# EAGLE design BUZZI-19b (EAGLE 4.15)
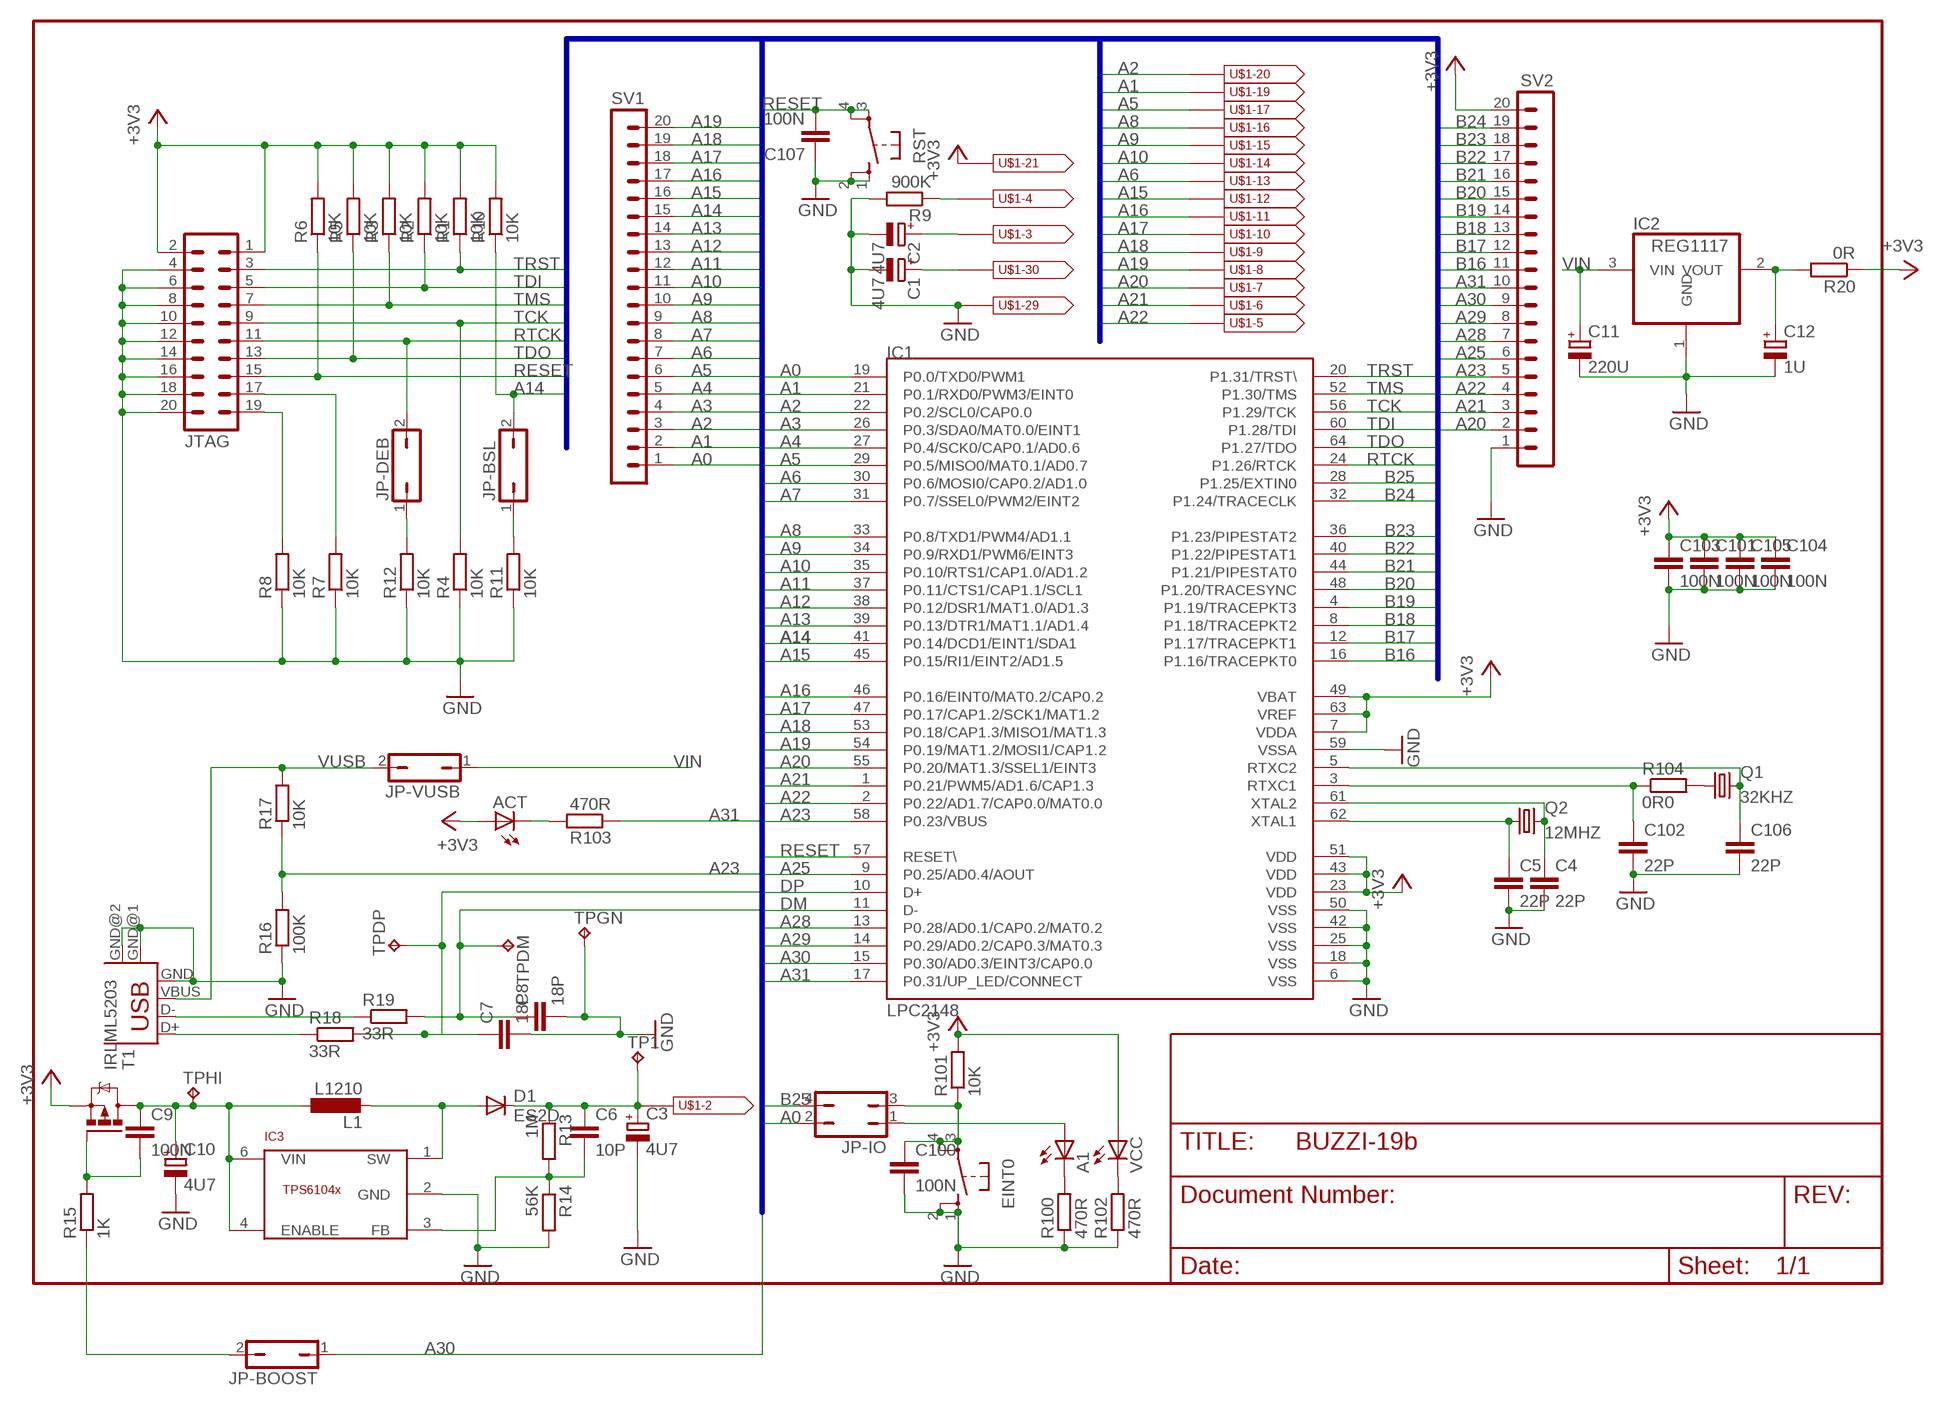
[diagram p0: schematic, sheet 1]

## Parts
A1  LEDCHIP-LED0805  [CHIP-LED0805]
ACT  LEDCHIP-LED0805  [CHIP-LED0805]
C1  4U7  CPOL-EUCT3528  [CT3528]
C2  4U7  CPOL-EUCT3528  [CT3528]
C3  4U7  CPOL-EUCT3528  [CT3528]
C4  22P  C-EUC0805  [C0805]
C5  22P  C-EUC0805  [C0805]
C6  10P  C-EUC0805  [C0805]
C7  18P  C-EUC0805  [C0805]
C8  18P  C-EUC0805  [C0805]
C9  100N  C-EUC0805  [C0805]
C10  4U7  CPOL-EUCT3528  [CT3528]
C11  220U  CPOL-EUCT7343  [CT7343]
C12  1U  CPOL-EUCT3528  [CT3528]
C100  100N  C-EUC0805  [C0805]
C101  100N  C-EUC0805  [C0805]
C102  22P  C-EUC0805  [C0805]
C103  100N  C-EUC0805  [C0805]
C104  100N  C-EUC0805  [C0805]
C105  100N  C-EUC0805  [C0805]
C106  22P  C-EUC0805  [C0805]
C107  100N  C-EUC0805  [C0805]
D1  ES2D  [SMB]
EINT0  10XX  [B3F-10XX]
IC1  LPC2148  LPC2148FBD64  [TSQFP50P1200X1200X160-64N]
IC2  REG1117  [SOT223]
IC3  TPS6104X  [SOT23-6L]
JP-BOOST  JP1Q  [JP1]
JP-BSL  JP1Q  [JP1]
JP-DEB  JP1Q  [JP1]
JP-IO  JP2Q  [JP2Q]
JP-VUSB  JP1Q  [JP1]
JTAG  MA10-2  [MA10-2]
L1  L1210  [C1210]
Q1  32KHZ  CRYTALTC26V  [TC26V]
Q2  12MHZ  CRYTALHC49UP  [HC49UP]
R1  10K  R-EU_M0805  [M0805]
R2  10K  R-EU_M0805  [M0805]
R3  10K  R-EU_M0805  [M0805]
R4  10K  R-EU_M0805  [M0805]
R5  10K  R-EU_M0805  [M0805]
R6  10K  R-EU_M0805  [M0805]
R7  10K  R-EU_M0805  [M0805]
R8  10K  R-EU_M0805  [M0805]
R9  900K  R-EU_M0805  [M0805]
R10  10K  R-EU_M0805  [M0805]
R11  10K  R-EU_M0805  [M0805]
R12  10K  R-EU_M0805  [M0805]
R13  1M  R-EU_M0805  [M0805]
R14  56K  R-EU_M0805  [M0805]
R15  1K  R-EU_M0805  [M0805]
R16  100K  R-EU_M0805  [M0805]
R17  10K  R-EU_M0805  [M0805]
R18  33R  R-EU_M0805  [M0805]
R19  33R  R-EU_M0805  [M0805]
R20  0R  R-EU_M0805  [M0805]
R100  470R  R-EU_M0805  [M0805]
R101  10K  R-EU_M0805  [M0805]
R102  470R  R-EU_M0805  [M0805]
R103  470R  R-EU_M0805  [M0805]
R104  0R0  R-EU_M0805  [M0805]
RST  10XX  [B3F-10XX]
SV1  MA20-1  [MA20-1]
SV2  MA20-1  [MA20-1]
T1  IRLML5203  [MICRO3]
TP1  TPPAD1-13  [P1-13]
TPDM  TPPAD1-13  [P1-13]
TPDP  TPPAD1-13  [P1-13]
TPGN  TPPAD1-13  [P1-13]
TPHI  TPPAD1-13  [P1-13]
U$1  CONNECTOR30  [HIROSE-FH12-30S-05SH]
USB  USB-MB-H  [USB-MB-H]
VCC  LEDCHIP-LED0805  [CHIP-LED0805]

## Nets
+3V3: ACT.A C101.1 C103.1 C104.1 C105.1 IC1.7(VDDA) IC1.23(VDD) IC1.43(VDD) IC1.49(VBAT) IC1.51(VDD) IC1.63(VREF) JTAG.1 JTAG.2 R1.2 R2.2 R3.2 R5.2 R6.2 R10.2 R20.1 R101.2 SV2.20 T1.2(S) U$1.P$21 VCC.A
A0: IC1.19(P0.0/TXD0/PWM1) JP-IO.2 SV1.1
A1: IC1.21(P0.1/RXD0/PWM3/EINT0) SV1.2 U$1.P$19
A2: IC1.22(P0.2/SCL0/CAP0.0) SV1.3 U$1.P$20
A3: IC1.26(P0.3/SDA0/MAT0.0/EINT1) SV1.4
A4: IC1.27(P0.4/SCK0/CAP0.1/AD0.6) SV1.5
A5: IC1.29(P0.5/MISO0/MAT0.1/AD0.7) SV1.6 U$1.P$17
A6: IC1.30(P0.6/MOSI0/CAP0.2/AD1.0) SV1.7 U$1.P$13
A7: IC1.31(P0.7/SSEL0/PWM2/EINT2) SV1.8
A8: IC1.33(P0.8/TXD1/PWM4/AD1.1) SV1.9 U$1.P$16
A9: IC1.34(P0.9/RXD1/PWM6/EINT3) SV1.10 U$1.P$15
A10: IC1.35(P0.10/RTS1/CAP1.0/AD1.2) SV1.11 U$1.P$14
A11: IC1.37(P0.11/CTS1/CAP1.1/SCL1) SV1.12
A12: IC1.38(P0.12/DSR1/MAT1.0/AD1.3) SV1.13
A13: IC1.39(P0.13/DTR1/MAT1.1/AD1.4) SV1.14
A14: IC1.41(P0.14/DCD1/EINT1/SDA1) JP-BSL.2 R10.1 SV1.15
A15: IC1.45(P0.15/RI1/EINT2/AD1.5) SV1.16 U$1.P$12
A16: IC1.46(P0.16/EINT0/MAT0.2/CAP0.2) SV1.17 U$1.P$11
A17: IC1.47(P0.17/CAP1.2/SCK1/MAT1.2) SV1.18 U$1.P$10
A18: IC1.53(P0.18/CAP1.3/MISO1/MAT1.3) SV1.19 U$1.P$9
A19: IC1.54(P0.19/MAT1.2/MOSI1/CAP1.2) SV1.20 U$1.P$8
A20: IC1.55(P0.20/MAT1.3/SSEL1/EINT3) SV2.2 U$1.P$7
A21: IC1.1(P0.21/PWM5/AD1.6/CAP1.3) SV2.3 U$1.P$6
A22: IC1.2(P0.22/AD1.7/CAP0.0/MAT0.0) SV2.4 U$1.P$5
A23: IC1.58(P0.23/VBUS) R16.2 R17.1 SV2.5
A25: IC1.9(P0.25/AD0.4/AOUT) SV2.6
A28: IC1.13(P0.28/AD0.1/CAP0.2/MAT0.2) SV2.7
A29: IC1.14(P0.29/AD0.2/CAP0.3/MAT0.3) SV2.8
A30: IC1.15(P0.30/AD0.3/EINT3/CAP0.0) JP-BOOST.1 SV2.9
A31: IC1.17(P0.31/UP_LED/CONNECT) R103.1 SV2.10
B16: IC1.16(P1.16/TRACEPKT0) SV2.11
B17: IC1.12(P1.17/TRACEPKT1) SV2.12
B18: IC1.8(P1.18/TRACEPKT2) SV2.13
B19: IC1.4(P1.19/TRACEPKT3) SV2.14
B20: IC1.48(P1.20/TRACESYNC) SV2.15
B21: IC1.44(P1.21/PIPESTAT0) SV2.16
B22: IC1.40(P1.22/PIPESTAT1) SV2.17
B23: IC1.36(P1.23/PIPESTAT2) SV2.18
B24: IC1.32(P1.24/TRACECLK) SV2.19
B25: IC1.28(P1.25/EXTIN0) JP-IO.4
DM: C8.1 IC1.11(D-) R19.2 TPDM.1(TP)
DP: C7.1 IC1.10(D+) R18.2 TPDP.1(TP)
GND: C1.- C2.- C3.- C4.2 C5.2 C7.2 C8.2 C10.- C11.- C12.- C100.2 C101.2 C102.2 C103.2 C104.2 C105.2 C106.2 C107.1 EINT0.1 EINT0.2 IC1.6(VSS) IC1.18(VSS) IC1.25(VSS) IC1.42(VSS) IC1.50(VSS) IC1.59(VSSA) IC2.1(GND) IC3.2(GND) JTAG.4 JTAG.6 JTAG.8 JTAG.10 JTAG.12 JTAG.14 JTAG.16 JTAG.18 JTAG.20 R4.1 R7.1 R8.1 R9.2 R11.1 R12.1 R14.2 R16.1 R100.1 R102.1 RST.1 RST.2 SV2.1 TPGN.1(TP) U$1.P$29 USB.GND USB.GND@1(GND) USB.GND@2(GND)
N$1: Q1.1 R104.2
N$2: JP-DEB.1 R12.2
N$3: R19.1 USB.D-
N$4: R18.1 USB.D+
N$5: JP-BSL.1 R11.2
N$6: C1.+ U$1.P$30
N$7: ACT.C R103.2
N$8: JTAG.17 R7.2
N$9: C100.1 EINT0.3 EINT0.4 JP-IO.3 R101.1
N$10: JTAG.19 R8.2
N$11: A1.A JP-IO.1
N$12: A1.C R100.2
N$13: R102.2 VCC.C
N$14: C9.1 C10.+ IC3.4(ENABLE) IC3.6(VIN) L1.1 T1.3(D) TPHI.1(TP)
N$15: C2.+ U$1.P$3
N$16: R9.1 U$1.P$4
N$17: D1.A IC3.1(SW) L1.2
N$18: C3.+ C6.1 D1.C R13.1 TP1.1(TP) U$1.P$2
N$19: C6.2 IC3.3(FB) R13.2 R14.1
N$20: C12.+ IC2.2(VOUT) R20.2
N$21: C9.2 R15.2 T1.1(G)
N$22: JP-BOOST.2 R15.1
N$23: C5.1 IC1.62(XTAL1) Q2.1
N$24: C4.1 IC1.61(XTAL2) Q2.2
N$25: C102.1 IC1.3(RTXC1) R104.1
N$26: C106.1 IC1.5(RTXC2) Q1.2
RESET: C107.2 IC1.57(RESET\) JTAG.15 R6.1 RST.3 RST.4
RTCK: IC1.24(P1.26/RTCK) JP-DEB.2 JTAG.11
TCK: IC1.56(P1.29/TCK) JTAG.9 R4.2
TDI: IC1.60(P1.28/TDI) JTAG.5 R2.1
TDO: IC1.64(P1.27/TDO) JTAG.13 R5.1
TMS: IC1.52(P1.30/TMS) JTAG.7 R3.1
TRST: IC1.20(P1.31/TRST\) JTAG.3 R1.1
VIN: C11.+ IC2.3(VIN) JP-VUSB.1
VUSB: JP-VUSB.2 R17.2 USB.VBUS
Unconnected: U$1.P$1 U$1.P$18 U$1.P$22 U$1.P$23 U$1.P$24 U$1.P$25 U$1.P$26 U$1.P$27 U$1.P$28

## Buses
ARM7:A[0..31],B[0..31],RESET,DP,DM,TRST,TMS,TCK,TDI,TDO,RTCK

## Library data of the parts
A1 ACT VCC = led:LED: LED OSRAM: - CHIPLED LG R971, LG N971, LY N971, LG Q971, LY Q971, LO R971, LY R971 LH N974, LH R974 LS Q976, LO Q976, LY Q976 LO Q996 - Hyper CHIPLED LW Q18S LB Q993, LB Q99A, LB R99A - SideLED LS A670, LO A670, LY A670, LG A670, LP A670 LB A673, LV A673, LT A673, LW A673 LH A674 LY A675 LS A676, LA A676, LO A676, LY A676, LW A676 LS A679, LY A679, LG A679 - Hyper Micro SIDELED® LS Y876, LA Y876, LO Y876, LY Y876 LT Y87S - SmartLED LW L88C, LW L88S LB L89C, LB L89S, LG L890 LS L89K, LO L89K, LY L89K LS L896, LA L896, LO L896, LY L896 - TOPLED LS T670, LO T670, LY T670, LG T670, LP T670 LSG T670, LSP T670, LSY T670, LOP T670, LYG T670 LG T671, LOG T671, LSG T671 LB T673, LV T673, LT T673, LW T673 LH T674 LS T676, LA T676, LO T676, LY T676, LB T676, LH T676, LSB T676, LW T676 LB T67C, LV T67C, LT T67C, LS T67K, LO T67K, LY T67K, LW E67C LS E67B, LA E67B, LO E67B, LY E67B, LB E67C, LV E67C, LT E67C LW T67C LS T679, LY T679, LG T679 LS T770, LO T770, LY T770, LG T770, LP T770 LB T773, LV T773, LT T773, LW T773 LH T774 LS E675, LA E675, LY E675, LS T675 LS T776, LA T776, LO T776, LY T776, LB T776 LHGB T686 LT T68C, LB T68C - Hyper Mini TOPLED® LB M676 - Mini TOPLED Santana® LG M470 LS M47K, LO M47K, LY M47K Source: http://www.osram.convergy.de/
C1-C3 C10-C12 = rcl:CPOL-EU: POLARIZED CAPACITOR, European symbol
C4-C9 C100-C107 = rcl:C-EU: CAPACITOR, European symbol
D1 = diode:ES2D: DIODE super fast rectifier, 2 A
EINT0 RST = KEY_B:10XX
IC1 = philips-5:LPC2148
IC2 = burr-brown:REG1117: 800mA and 1A Low Dropout (LDO) Positive Regulator 1.8V, 2.5V, 2.85V, 3.3V, 5V, and Adj
IC3 = turbod3:TPS6104X
JP-BOOST JP-BSL JP-DEB JP-VUSB = jumper:JP1Q: JUMPER
JP-IO = jumper:JP2Q: JUMPER
JTAG = con-lstb:MA10-2: PIN HEADER
L1 = turbod3:L
Q1 = crystal:CRYTAL: CRYSTAL
Q2 = turbod3:CRYTAL: CRYSTAL
R1-R20 R100-R104 = rcl:R-EU_: RESISTOR, European symbol
SV1 SV2 = turbod3:MA20-1: PIN HEADER
T1 = transistor-power:IRLML5203: HEXFET P-Channel Power MOSFET
TP1 TPDM TPDP TPGN TPHI = testpad:TP
U$1 = turbod3:CONNECTOR30
USB = con-usb-2:USB: USB Connectors

## Board
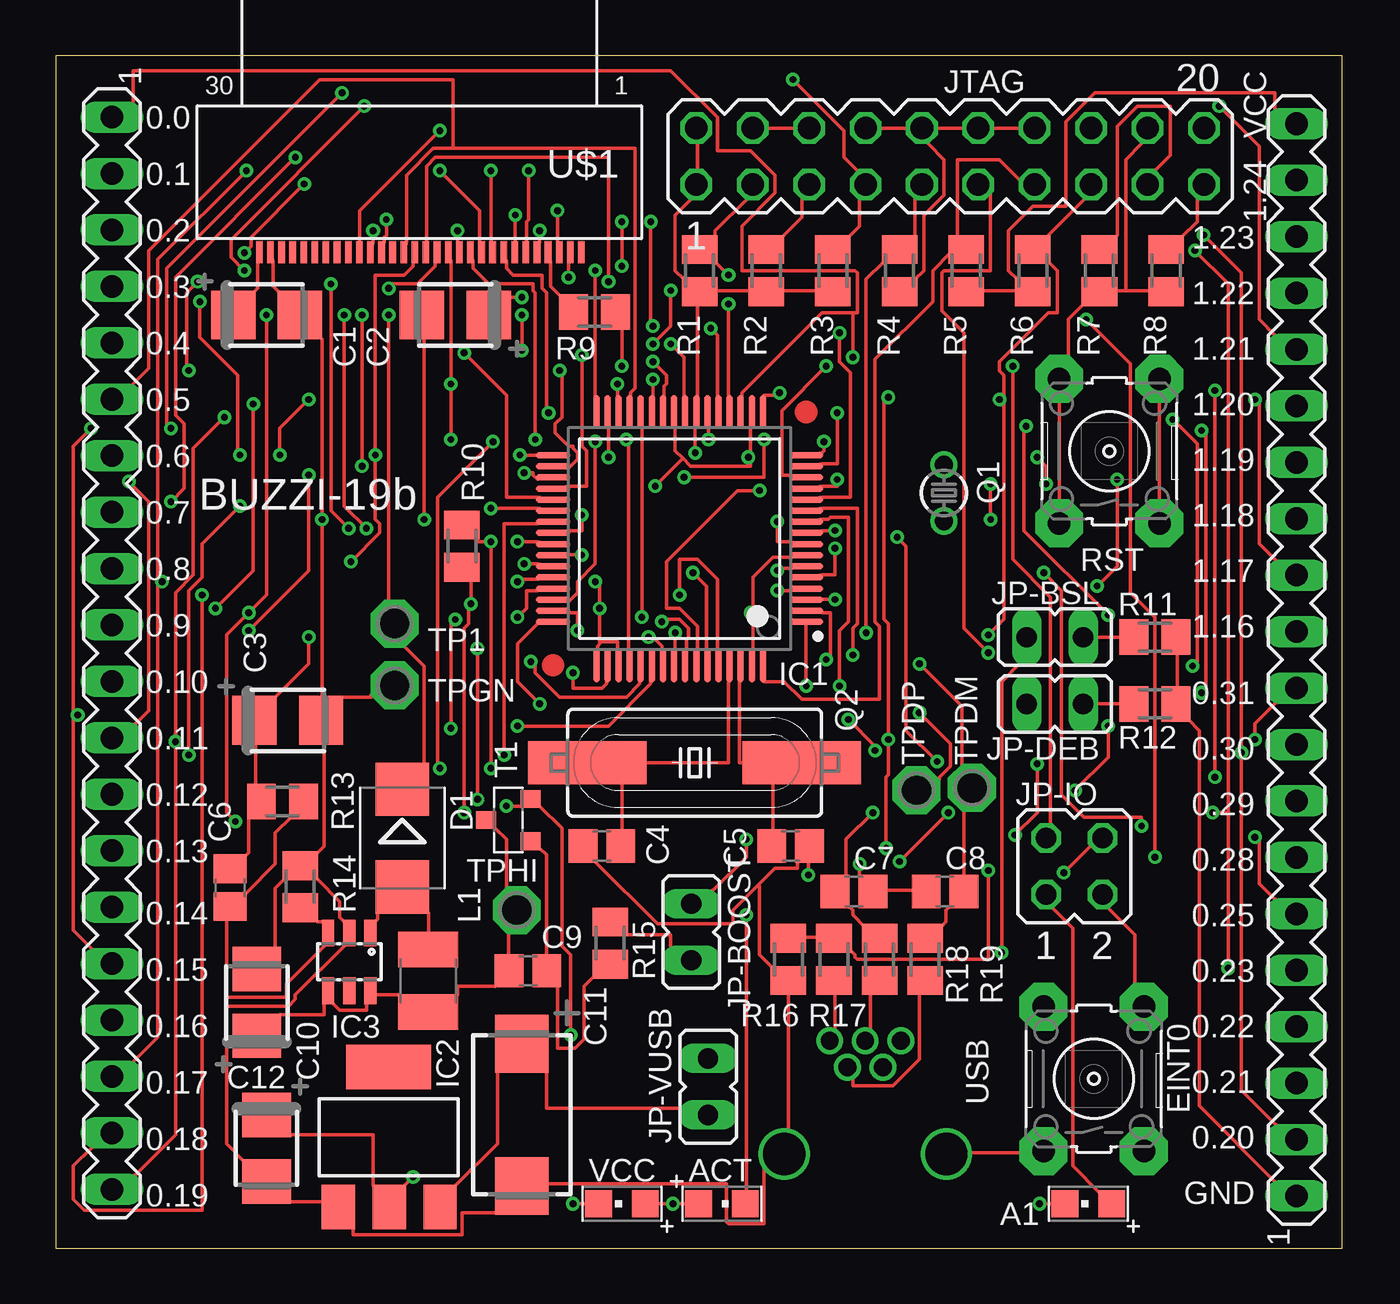
[diagram p1: board, top side]
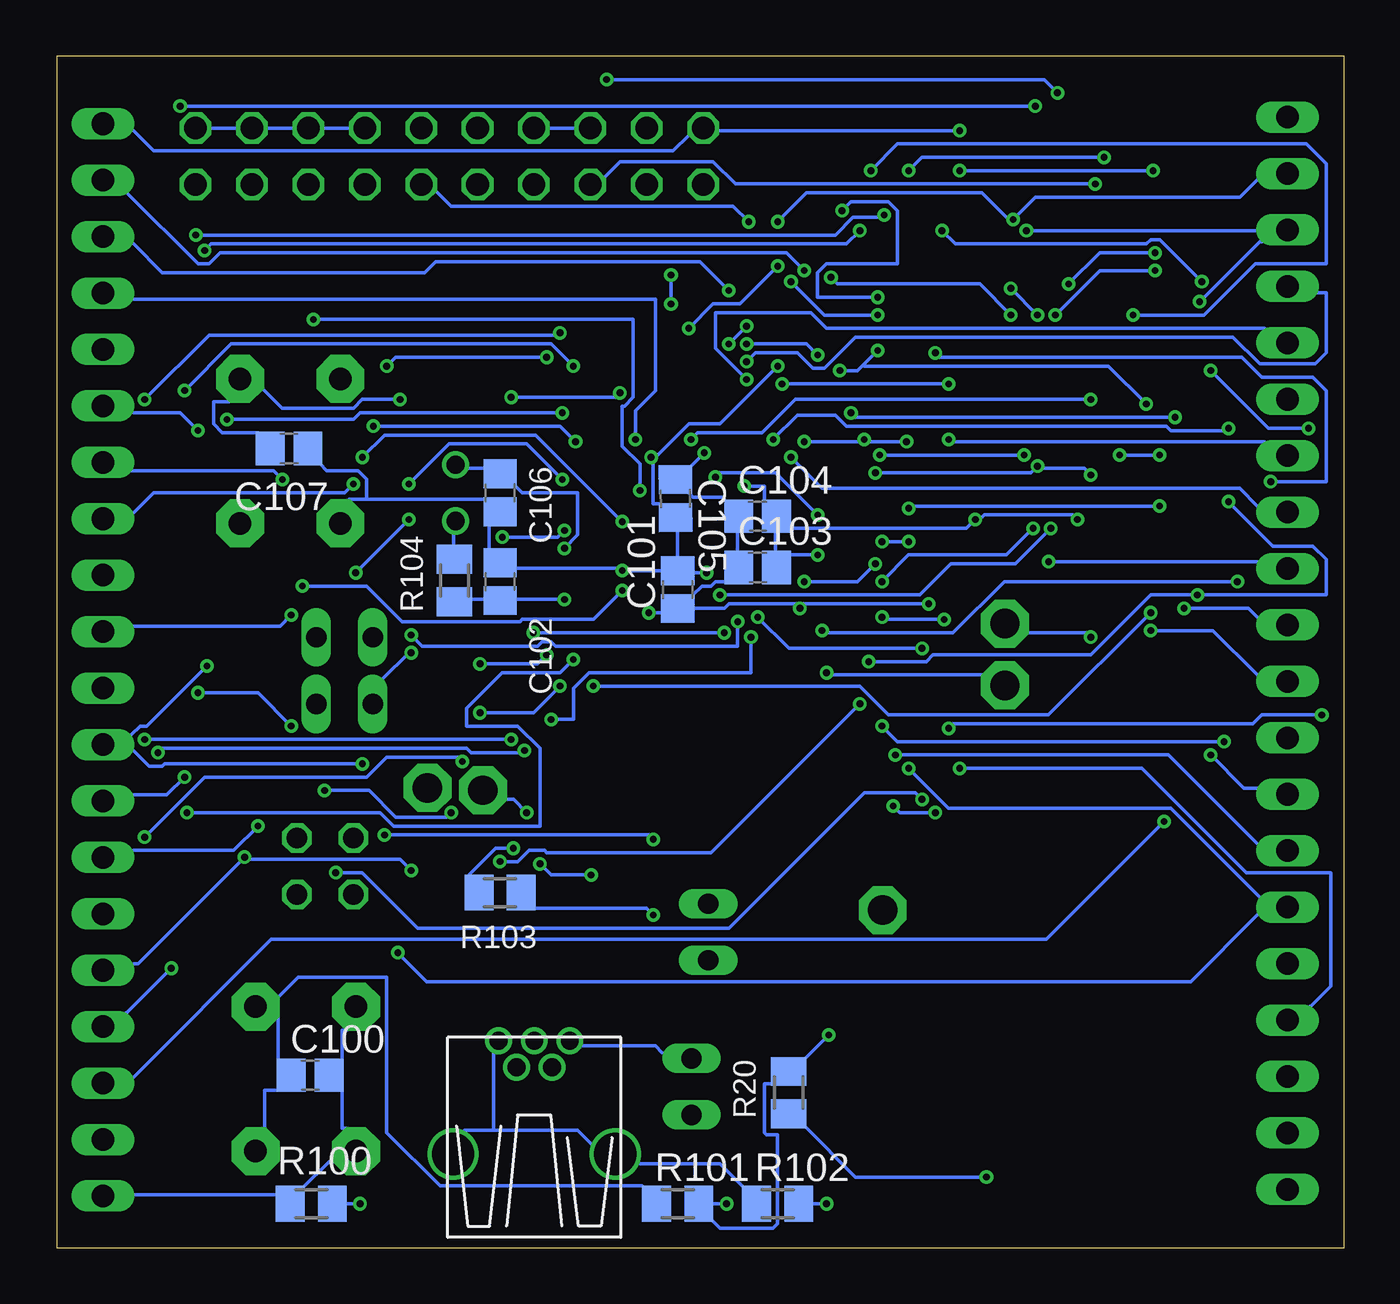
[diagram p2: board, bottom side, seen from below]

Size 57.94 x 53.68 mm. Coordinates in mm from the lower left corner, seen from the top.
Outline: 0,0 57.94,0 57.94,53.68 0,53.68 0,0
Copper layers (1*16): Top 0.035mm / dielectric 1.5mm / Bottom 0.035mm
Design rules "PCB-POOL": minimum track width 6mil, minimum drill 12mil, track to track 6mil, track to pad 6mil, pad to pad 6mil, via to via 6mil, smd to smd 6mil, copper to edge 20mil, drill to drill 8mil, minimum pad ring 8mil, minimum via ring 6mil, stop-mask expansion 3mil, vias tented up to drill 0mil, thermal gap 8mil

### Footprints (pad centres in the part's own frame; a part is rotated, then mirrored left to right if it is on the bottom)
CHIP-LED0805 = smd 1.2 x 1.2: A 0,-1.05; C 0,1.05
CT3528 = smd 2 x 2.2: + 1.5,0; - -1.5,0
C0805 = smd 1.3 x 1.5: 1 -0.85,0; 2 0.85,0
CT7343 = smd 2.6 x 2.4: + 3.2,0; - -3.2,0
SMB = smd 2.4 x 2.4: A 2.2,0; C -2.2,0
B3F-10XX = drill 1.016 pad 2.159 octagon: 1 -3.379,2.312; 2 3.123,2.312; 3 -3.379,-2.209; 4 3.123,-2.209
TSQFP50P1200X1200X160-64N = smd 1.55 x 0.3: 1 -5.7,3.75; 2 -5.7,3.25; 3 -5.7,2.75; 4 -5.7,2.25; 5 -5.7,1.75; 6 -5.7,1.25; 7 -5.7,0.75; 8 -5.7,0.25; 9 -5.7,-0.25; 10 -5.7,-0.75; 11 -5.7,-1.25; 12 -5.7,-1.75; 13 -5.7,-2.25; 14 -5.7,-2.75; 15 -5.7,-3.25; 16 -5.7,-3.75; 33 5.7,-3.75; 34 5.7,-3.25; 35 5.7,-2.75; 36 5.7,-2.25; 37 5.7,-1.75; 38 5.7,-1.25; 39 5.7,-0.75; 40 5.7,-0.25; 41 5.7,0.25; 42 5.7,0.75; 43 5.7,1.25; 44 5.7,1.75; 45 5.7,2.25; 46 5.7,2.75; 47 5.7,3.25; 48 5.7,3.75 | smd 0.3 x 1.55: 17 -3.75,-5.7; 18 -3.25,-5.7; 19 -2.75,-5.7; 20 -2.25,-5.7; 21 -1.75,-5.7; 22 -1.25,-5.7; 23 -0.75,-5.7; 24 -0.25,-5.7; 25 0.25,-5.7; 26 0.75,-5.7; 27 1.25,-5.7; 28 1.75,-5.7; 29 2.25,-5.7; 30 2.75,-5.7; 31 3.25,-5.7; 32 3.75,-5.7; 49 3.75,5.7; 50 3.25,5.7; 51 2.75,5.7; 52 2.25,5.7; 53 1.75,5.7; 54 1.25,5.7; 55 0.75,5.7; 56 0.25,5.7; 57 -0.25,5.7; 58 -0.75,5.7; 59 -1.25,5.7; 60 -1.75,5.7; 61 -2.25,5.7; 62 -2.75,5.7; 63 -3.25,5.7; 64 -3.75,5.7
SOT223 = smd 1.499 x 2.007: 1 -2.261,-3.15; 2 0.025,-3.15; 3 2.311,-3.15 | smd 3.81 x 2.007: 4 0,3.15
SOT23-6L = smd 0.55 x 1.2: 1 -0.95,-1.3; 2 0,-1.3; 3 0.95,-1.3; 4 0.95,1.3; 5 0,1.3; 6 -0.95,1.3
JP1 = drill 0.914 long: 1 0,-1.27; 2 0,1.27
JP2Q = drill 0.914 octagon: 1 -1.27,-1.27; 2 -1.27,1.27; 3 1.27,-1.27; 4 1.27,1.27
MA10-2 = drill 1.016 octagon: 1 -11.43,-1.27; 2 -11.43,1.27; 3 -8.89,-1.27; 4 -8.89,1.27; 5 -6.35,-1.27; 6 -6.35,1.27; 7 -3.81,-1.27; 8 -3.81,1.27; 9 -1.27,-1.27; 10 -1.27,1.27; 11 1.27,-1.27; 12 1.27,1.27; 13 3.81,-1.27; 14 3.81,1.27; 15 6.35,-1.27; 16 6.35,1.27; 17 8.89,-1.27; 18 8.89,1.27; 19 11.43,-1.27; 20 11.43,1.27
C1210 = smd 1.6 x 2.7: 1 -1.4,0; 2 1.4,0
TC26V = drill 0.813 round: 1 -1.27,0; 2 1.27,0
HC49UP = smd 5.334 x 1.93: 1 -4.826,0; 2 4.826,0
M0805 = smd 1.3 x 1.6: 1 -0.95,0; 2 0.95,0
MA20-1 = drill 1.016 long: 1 -24.13,0; 2 -21.59,0; 3 -19.05,0; 4 -16.51,0; 5 -13.97,0; 6 -11.43,0; 7 -8.89,0; 8 -6.35,0; 9 -3.81,0; 10 -1.27,0; 11 1.27,0; 12 3.81,0; 13 6.35,0; 14 8.89,0; 15 11.43,0; 16 13.97,0; 17 16.51,0; 18 19.05,0; 19 21.59,0; 20 24.13,0
MICRO3 = smd 0.8 x 0.9: 1 -0.95,-1; 2 0.95,-1; 3 0,1
P1-13 = drill 1.321 pad 2.159 octagon: 1 0,0
HIROSE-FH12-30S-05SH = smd 0.3 x 1: P$1 -7.3,3.6; P$2 -6.8,3.6; P$3 -6.3,3.6; P$4 -5.8,3.6; P$5 -5.3,3.6; P$6 -4.8,3.6; P$7 -4.3,3.6; P$8 -3.8,3.6; P$9 -3.3,3.6; P$10 -2.8,3.6; P$11 -2.3,3.6; P$12 -1.8,3.6; P$13 -1.3,3.6; P$14 -0.8,3.6; P$15 -0.3,3.6; P$16 0.2,3.6; P$17 0.7,3.6; P$18 1.2,3.6; P$19 1.7,3.6; P$20 2.2,3.6; P$21 2.7,3.6; P$22 3.2,3.6; P$23 3.7,3.6; P$24 4.2,3.6; P$25 4.7,3.6; P$26 5.2,3.6; P$27 5.7,3.6; P$28 6.2,3.6; P$29 6.7,3.6; P$30 7.2,3.6
USB-MB-H = drill 0.8 round: D+ 5.1,0; D- 3.9,0.8; GND 5.1,-1.6; ID 3.9,-0.8; VBUS 5.1,1.6 | drill 1.9 round: GND@1 0,3.65; GND@2 0,-3.65

### Placement (x,y rotation side)
A1  46.5,2 90 top
ACT  30,2 270 top
C1  9.5,42 180 top
C2  18,42 0 top
C3  10.46,23.76 180 top
C4  24.6,18.1 180 top
C5  33.1,18.1 0 top
C6  7.86,16.23 270 top
C7  35.95,16.05 0 top
C8  40.05,16.05 180 top
C9  21.27,12.49 0 top
C10  9.07,11.06 270 top
C11  21,6 90 top
C12  9.5,4.5 90 top
C100  46.55,7.78 0 bottom
C101  30,29.64 90 bottom
C102  38,30 90 bottom
C103  26.4,30.64 0 bottom
C104  26.4,32.94 0 bottom
C105  30.1,33.74 270.4 bottom
C106  38,34 270 bottom
C107  47.5,36 180 bottom
D1  15.61,18.46 270 top
EINT0  46.8,7.75 90 top
IC1  28.1,31.94 180 top
IC2  15,5 0 top
IC3  13.23,12.89 180 top
JP-BOOST  28.62,14.23 180 top
JP-BSL  45,27.5 90 top
JP-DEB  45,24.5 90 top
JP-IO  45.87,17.19 0 top
JP-VUSB  29.38,7.27 0 top
JTAG  40.28,49.14 0 top
L1  16.78,12.04 90 top
Q1  40,34 90 top
Q2  28.78,21.85 180 top
R1  29,44 270 top
R2  32,44 270 top
R3  35,44 270 top
R4  38,44 90 top
R5  41,44 270 top
R6  44,44 270 top
R7  47,44 90 top
R8  50,44 90 top
R9  24.27,42.14 0 top
R10  18.3,31.6 270 top
R11  49.5,27.5 180 top
R12  49.5,24.5 180 top
R13  10.22,20.1 0 top
R14  11.02,16.27 90 top
R15  24.97,13.73 270 top
R16  33,13 90 top
R17  35.05,13 270 top
R18  37.1,13 90 top
R19  39.15,13 90 top
R20  25,7 270 bottom
R100  46.5,2 0 bottom
R101  30,2 0 bottom
R102  25.5,2 0 bottom
R103  38,16 0 bottom
R104  40.05,30.05 90 bottom
RST  47.5,36 90 top
SV1  2.54,26.78 270 top
SV2  55.88,26.48 90 top
T1  20.39,19.27 90 top
TP1  15.27,28.11 0 top
TPDM  41.27,20.72 0 top
TPDP  38.77,20.61 0 top
TPGN  15.27,25.33 0 top
TPHI  20.77,15.22 0 top
U$1  16.38,48.43 180 top
USB  36.46,4.24 90 top
VCC  25.5,2 90 top

### Tracks (layer width: path | path; a pad name or v marks a point on that pad's centre or on a via)
+3V3  (via drill 0.3)
  Top 0.152: VCC.A v27.8,2 ACT.A | v23.2,9.6 23.2,13.2 22.8,13.6 22.8,18.9 21.8,19.9 T1.2 21,19.9 v20.3,19.9 | R5.2 41.7,43.1 43.3,43.1 R6.2 43.3,43.6 42.9,44 42.9,45.8 44,46.9 45.5,46.9 45.5,50.7 46.8,52 54.9,52 54.9,51.3 SV2.20 | 24.55,27.25 24.6,27.3 25.3,27.3 25.3,27 IC1.51 | 24.55,27.25 24.4,27.1 24.4,27 IC1.49 | v21.1,30.8 21.7,30.8 IC1.43 | v24.3,30 24.5,29.8 v24.5,28.8 24.5,27.3 24.55,27.25 | 31.4,28.6 31.4,30.2 32.3,31.1 33.1,31.1 IC1.7 | 31.4,28.6 31.4,27 IC1.63 | R10.2 18.7,30.1 v18.7,29 18.6,28.7 18.6,28.1 18.4,27.9 v18.4,19.6 | v31.3,28.6 31.4,28.6 | R3.2 34.3,43.1 32.7,43.1 R2.2 31.3,43.1 29.7,43.1 R1.2 | R1.2 28.9,42.5 28.9,38.4 IC1.23 28.8,36.9 v28.8,35.8 | v17.3,50.3 13.7,46.7 13.7,45.3 U$1.P$21 | JTAG.2 28.9,49.7 28.9,48.5 JTAG.1 28.6,47.2 27.9,46.5 27.9,44 28.3,43.6 R1.2
  Bottom 0.152: v23.2,9.6 24.3,8.5 R20.1 25.7,7.4 26.1,7.4 26.1,5.2 26,5.1 25.5,5.1 25.5,1.1 25.7,0.9 28.1,0.9 28.5,1.3 R101.2 v27.8,2 | v21.1,30.8 21.9,30 v24.3,30 | C101.1 29.3,29.4 28.9,29.8 28.5,29.8 28.3,30 27.8,30 C103.1 27.3,31.3 27.3,32.2 C104.1 27.8,33.6 28,33.8 29.3,33.8 29.4,33.9 C105.1 29.4,35.2 v28.8,35.8 | 24.5,29 27.7,29 27.9,28.8 29.3,28.8 C101.1 | v18.7,29 24.5,29 | v31.3,28.6 30.7,28.6 C101.1 | 24.5,29 v24.5,28.8 | v17.3,50.3 28.2,50.3 JTAG.2 29.5,50.1 30.2,49.4 53.6,49.4 54.5,50.3 SV2.20 | v20.3,19.9 20,19.6 v18.4,19.6
A0  (via drill 0.3)
  Top 0.152: 35.9,42.1 36.1,42.1 36.1,43.9 36,44 30.9,44 30.9,46 32.4,47.5 32.4,48.3 31.3,49.4 29.8,49.4 29.8,50.9 27.7,53 3.5,53 3.5,51.6 SV1.1 | 35.9,42.1 34.5,42.1 30.9,38.5 30.9,38.4 IC1.19 | v43.1,39.7 43.1,31 44.8,29.3 44.8,19.1 JP-IO.2 | 35.9,42.1 v35.9,40.1
  Bottom 0.152: v43.1,39.7 42.7,40.1 v35.9,40.1
A1  (via drill 0.3)
  Top 0.152: v14.9,46.3 14.9,45.6 14.8,45.5 14.8,45.3 U$1.P$19 | v29.5,41.4 29.8,41.1 29.8,38.4 IC1.21 | v25.5,46.2 v25.5,44.2
  Bottom 0.152: SV1.2 3.9,48.1 4.7,47.3 13.9,47.3 v14.9,46.3 15.2,46.4 16.3,47.5 24.2,47.5 v25.5,46.2 | v29.5,41.4 28.4,42.5 27.2,42.5 v25.5,44.2
A2  (via drill 0.3)
  Top 0.152: v14.3,45.8 14.3,45.3 U$1.P$20 | v29.4,36.4 29.4,36.9 IC1.22 | v11.4,38.2 10.1,36.9 v10.1,35.7 | v8.3,35.7 8.2,35.8 8.2,39.3 6.5,41 v6.5,42.6
  Bottom 0.152: v14.3,45.8 3.9,45.8 SV1.3 3.7,45.3 3.8,45.3 v6.5,42.6 | v29.4,36.4 29.1,36.7 26.2,36.7 24.7,38.2 v11.4,38.2 | v8.3,35.7 v10.1,35.7
A3  (via drill 0.3)
  Top 0.152: v26.9,39.9 27.5,39.3 27.5,38.9 27.4,38.8 27.4,38.4 IC1.26
  Bottom 0.152: v26.9,39.9 26.5,40.3 24.6,40.3 23.9,39.6 23.4,39.6 22,41 5,41 3.8,39.8 1.3,39.8 0.8,40.3 0.8,43 1.2,43 SV1.4
A4  (via drill 0.3)
  Top 0.152: v26.9,39.1 26.9,38.4 IC1.27
  Bottom 0.152: v26.9,39.1 28.3,40.5 28.3,42.1 24,42.1 23.3,41.4 3.6,41.4 SV1.5
A5
  Top 0.152: 17.9,49.5 26.1,49.5 26.1,38.7 25.9,38.5 25.9,38.4 IC1.29 | 17.9,49.5 17,49.5 15.8,48.3 15.8,45.3 U$1.P$17 | 17.9,49.5 17.9,52.6 11.9,52.6 4.2,44.9 4.2,39.6 3.5,38.9 SV1.6
A6  (via drill 0.3)
  Top 0.152: v17.8,36.4 v17.8,38.9 17.8,44.4 U$1.P$13 | v25.3,38.9 25.3,38.4 IC1.30
  Bottom 0.152: v17.8,36.4 17.7,36.3 3.6,36.3 SV1.7 | v17.8,38.9 v25.3,38.9
A7  (via drill 0.3)
  Top 0.152: v24.9,35.6 24.9,36.9 IC1.31
  Bottom 0.152: v24.9,35.6 23.5,34.2 4.7,34.2 3.9,33.4 SV1.8
A8  (via drill 0.3)
  Top 0.152: v13.3,30.9 14.6,32.2 14.6,32.6 14.4,32.8 v14.4,35.7 14.4,43.8 15.7,43.8 16.1,44.2 16.1,44.4 U$1.P$16 | v20.9,35.7 21.7,35.7 IC1.33
  Bottom 0.152: v13.3,30.9 3.9,30.9 SV1.9 | v14.4,35.7 v20.9,35.7
A9  (via drill 0.3)
  Top 0.152: v24.9,43.5 24.9,49.1 17.1,49.1 16.7,48.7 16.7,45.3 U$1.P$15 | v21,40.4 v21,42 | v22.7,39.5 22.8,39.4 22.8,37.4 22.5,37.1 22.5,36.7 23.1,36.1 23.3,36.1 23.3,36 23.5,35.8 23.5,35.5 23.1,35.1 IC1.34 | v7.2,28.8 8.9,30.5 v8.9,38
  Bottom 0.152: v24.9,43.5 23.4,42 v21,42 | 21.65,39.75 21.9,39.5 v22.7,39.5 | 21.65,39.75 v21,40.4 | v7.2,28.8 4.3,28.8 3.9,28.4 SV1.10 | v8.9,38 10.6,39.7 21.6,39.7 21.65,39.75
A10  (via drill 0.3)
  Top 0.152: v15,43.2 15,43.4 16.3,43.4 17.1,44.2 17.1,44.4 U$1.P$14 | v13.8,35.2 v13.8,42 | v21.1,34.9 21.5,34.9 21.5,34.8 21.7,34.6 IC1.35 | v8.7,27.8 11.4,30.5 v11.4,34.8
  Bottom 0.152: v13.8,42 v15,43.2 | v21.1,34.9 14.1,34.9 v13.8,35.2 13.5,35.1 11.7,35.1 v11.4,34.8 | v8.7,27.8 5.9,27.8 3.9,25.8 SV1.11
A11  (via drill 0.3)
  Top 0.152: v18.4,40.3 20.3,38.4 20.3,33.8 21.7,33.8 IC1.37 | v3.3,34.5 4.2,33.6 4.2,24.2 3.6,23.6 SV1.12
  Bottom 0.152: v18.4,40.3 18.2,40.1 4.6,40.1 3.7,39.2 1.4,39.2 0.8,38.6 0.8,34.5 v3.3,34.5
A12  (via drill 0.3)
  Top 0.152: v19.6,33.3 21.7,33.3 IC1.38 | v8.3,33.4 6.6,31.7 6.6,30.2 6,29.6 v6,22.2
  Bottom 0.152: v19.6,33.3 19.5,33.4 v8.3,33.4 | v6,22.2 4.5,20.7 3.9,20.7 SV1.13
A13  (via drill 0.3)
  Top 0.152: v20.2,22.2 20.2,32.6 21.7,32.6 IC1.39
  Bottom 0.152: v20.2,22.2 7.9,22.2 3.9,18.2 SV1.14
A14  (via drill 0.3)
  Top 0.152: v20.8,31.8 21.7,31.8 IC1.41 | R10.1 19,32 19,31.8 v19.6,31.8 v19.6,21.6 | v42.6,13.3 42.6,25.5 43.4,26.3 JP-BSL.2
  Bottom 0.152: v19.6,31.8 v20.8,31.8 | v42.6,13.3 41.3,12 6.9,12 3.9,15 SV1.15 3.8,15.8 7.8,19.8 17.8,19.8 v19.6,21.6
A15  (via drill 0.3)
  Top 0.152: v18.1,45.8 18.1,45.3 U$1.P$12 | v6.4,43.5 5.9,43 5.9,39.6 v6,39.5 | v1.6,36.9 0.8,36.1 0.8,24 | 0.8,24 0.8,14.3 1.6,13.5 SV1.16 | v20.8,28.4 21.2,28.8 21.2,29.6 21.7,29.6 IC1.45 | v18,28.3 17.8,28.1 v17.8,23.4 | 0.8,24 v1,24
  Bottom 0.152: v18.1,45.8 17.5,45.2 8.9,45.2 8.7,45.4 8.3,45.4 v6.4,43.5 | v6,39.5 3.4,36.9 v1.6,36.9 | v20.8,28.4 20.7,28.3 v18,28.3 | v17.8,23.4 17.6,23.6 4.1,23.6 3.7,24 v1,24
A16  (via drill 0.3)
  Top 0.152: v21.6,36.4 21.6,43 21.5,43.1 21.5,43.4 19.5,43.4 18.8,44.1 18.8,44.4 U$1.P$11 | v24.3,36.3 24.3,30.8 23.5,30 23.5,29.5 23.1,29.1 IC1.46 | v17.3,21.6 17.2,21.7 17.2,33.8 v19.7,36.3
  Bottom 0.152: v24.3,36.3 21.7,36.3 v21.6,36.4 21.3,36.3 v19.7,36.3 | v17.3,21.6 9.1,21.6 4.4,16.9 0.6,16.9 0.6,11.8 1.5,10.9 SV1.17
A17  (via drill 0.3)
  Top 0.152: v17.3,48.5 19.1,46.7 19.1,45.3 U$1.P$10 | v8.6,48.5 4.6,44.5 4.6,30 | 4.6,30 4.6,9.5 3.5,8.4 SV1.18 | v23.5,27.8 23.5,28.6 23.1,28.6 IC1.47 | 4.6,30 v4.8,30
  Bottom 0.152: v8.6,48.5 v17.3,48.5 | v23.5,27.8 23.4,27.7 17.6,27.7 15.3,30 v4.8,30
A18  (via drill 0.3)
  Top 0.152: v19.6,48.5 19.6,45.3 U$1.P$9 | v10.8,49.1 5.4,43.7 5.4,37.5 5.8,37.1 5.8,34.2 v5.2,33.6 | v21.4,26.4 21.6,26.2 21.6,25.9 22.7,24.8 25.7,24.8 26.3,25.4 26.3,25.5 IC1.53 | v6.6,29.4 6.6,1.7 1.3,1.7 0.8,2.2 0.8,3.7 1.6,4.5 SV1.19
  Bottom 0.152: v19.6,48.5 19,49.1 v10.8,49.1 | v5.2,33.6 3.2,31.6 1.4,31.6 0.8,31 0.8,29.4 v6.6,29.4 8.7,29.4 11.4,26.7 18.5,26.7 18.8,26.4 v21.4,26.4
A19  (via drill 0.3)
  Top 0.152: v22.2,37.6 22.1,37.7 22.1,43 21.9,43.2 21.9,43.8 20.6,43.8 20.3,44.1 20.3,44.4 U$1.P$8 | v7.6,37.4 6.2,36 6.2,30.3 5.4,29.5 v5.4,22.8 5.4,5.1 3.6,3.3 SV1.20 | v20.8,23.5 24.9,23.5 26.8,25.4 26.8,25.5 IC1.54
  Bottom 0.152: v22.2,37.6 22,37.4 v7.6,37.4 | v20.8,23.5 20.1,22.8 v5.4,22.8
A20  (via drill 0.3)
  Top 0.152: v20.7,46.5 20.7,45.3 U$1.P$7 | v51.7,45.6 53.4,43.9 v53.4,22.3 53.4,7.1 54.9,5.6 SV2.2 | v26.7,27.5 26.9,27.5 27.3,27.1 27.3,27 IC1.55 | v35.7,23.8 36.9,22.6 v36.9,22.4
  Bottom 0.152: v20.7,46.5 20.8,46.4 22.1,46.4 22.9,45.6 v51.7,45.6 | v26.7,27.5 26.7,25.9 34,25.9 34.7,25.2 34.7,23.8 v35.7,23.8 | v36.9,22.4 37,22.3 39.3,22.3 39.5,22.5 53.2,22.5 v53.4,22.3
A21  (via drill 0.3)
  Top 0.152: v21.3,48.5 21.3,46.3 21.2,46.2 21.2,45.3 U$1.P$6 | v9.5,42 9.5,29.4 v8.7,28.6 7.7,27.6 7.7,19.6 v8.1,19.2 | v33.8,25.3 IC1.1
  Bottom 0.152: v21.3,48.5 20.1,49.7 1.7,49.7 0.8,48.8 0.8,44.3 4,44.3 6.3,42 v9.5,42 | v8.7,28.6 13.3,24 20.5,24 21.8,25.3 v33.8,25.3 | v8.1,19.2 13.4,13.9 48.3,13.9 54.5,7.7 SV2.3
A22  (via drill 0.3)
  Top 0.152: v21.8,45.8 21.8,45.3 U$1.P$5 | v51.3,44.9 52.8,43.4 52.8,19.6 | 52.8,19.6 v52.8,12.6 | v34.7,26.5 34.9,26.7 34.9,28.6 34.5,28.6 IC1.2 | v52.1,19.6 52.8,19.6
  Bottom 0.152: v21.8,45.8 22.4,45.2 51,45.2 v51.3,44.9 | v52.8,12.6 54.8,10.6 SV2.4 | v34.7,26.5 35.3,25.9 37.9,25.9 39.5,24.3 39.5,23.5 37.2,23.5 36.2,22.5 36.2,19 42.8,19 43.4,19.6 v52.1,19.6
A23  (via drill 0.3)
  Top 0.152: R16.2 33.7,14 34.3,14 R17.1 35.8,13.4 36,13.2 36,13.1 36.1,13 42,13 v42,17 | v31.7,34.1 30.7,34.1 27.5,30.9 27.5,28.8 28.1,28.8 28.9,28 28.9,27 IC1.58 | v46.4,41.8 48.4,39.8 48.4,29.5 49.5,28.4 v49.5,17.6
  Bottom 0.152: v31.7,34.1 31.7,35.3 32.5,36.1 32.5,37.9 32.4,37.9 32,38.3 32,41.8 v46.4,41.8 | SV2.5 54.5,12.8 54.3,12.8 v49.5,17.6 49.2,17.5 42.5,17.5 v42,17
A25  (via drill 0.3)
  Top 0.152: v35.1,32.3 34.5,32.3 IC1.9 | v37.9,32 38.3,31.6 38.3,23.3 v39.7,21.9 | v54,18.5 54.2,18.3 54.2,16.4 54.9,15.7 SV2.6
  Bottom 0.152: v35.1,32.3 35.4,32 v37.9,32 | v39.7,21.9 39.9,22.1 43.1,22.1 44,21.2 51.3,21.2 v54,18.5
A28  (via drill 0.3)
  Top 0.152: v35.2,34.6 35.2,34.3 34.5,34.3 IC1.13 | v42.1,32.8 v42.1,34.4 | v44.5,30.4 45.3,29.6 45.3,20.4 46.3,19.4 48.9,19.4 v48.9,19
  Bottom 0.152: v35.2,34.6 36.8,36.2 40.3,36.2 v42.1,34.4 | v44.5,30.4 v42.1,32.8 | v48.9,19 50,17.9 54.5,17.9 SV2.7
A29  (via drill 0.3)
  Top 0.152: v34.7,39.7 32.7,37.7 32.7,34.8 33.1,34.8 IC1.14 | v52.2,38.6 v52.2,21.2
  Bottom 0.152: v34.7,39.7 35.7,40.7 50.1,40.7 v52.2,38.6 | v52.2,21.2 53,20.4 54.5,20.4 SV2.8
A30  (via drill 0.3)
  Top 0.152: v35.2,37.6 35.2,35.3 34.5,35.3 IC1.15 | v50.3,37.3 51.4,36.2 51.4,26.4 v51.2,26.2 | v31.1,18.4 31.1,17.6 29.6,16.1 JP-BOOST.1 | v43.2,18.6 44.2,19.6 v44.2,21.8
  Bottom 0.152: v35.2,37.6 44.3,37.6 44.6,37.3 v50.3,37.3 | v51.2,26.2 53.9,23.5 54.2,23.5 54.6,23.1 SV2.9 54.5,22.4 53.8,21.7 53.2,21.7 53.1,21.8 v44.2,21.8 | v31.1,18.4 31.3,18.6 v43.2,18.6
A31  (via drill 0.3)
  Top 0.152: v32.6,38.5 32.6,38.4 31.9,38.4 IC1.17 | v37.5,38.3 37.3,38.1 37.3,28.3 37.5,28.1 v37.5,22.9 37.5,21.3 37.4,21.2 v37.4,18 | v54,22.9 54,23.6 54.9,24.5 SV2.10
  Bottom 0.152: v32.6,38.5 32.8,38.3 v37.5,38.3 | v37.4,18 38.2,18 39.5,16.7 R103.1 | v37.5,22.9 v54,22.9
B16  (via drill 0.3)
  Top 0.152: v34.6,36.3 34.6,35.9 34.5,35.8 IC1.16 | v43.7,37 43.6,36.9 43.6,32.3 v47.4,28.5
  Bottom 0.152: v34.6,36.3 35.3,37 v43.7,37 | v47.4,28.5 47.9,28 54.5,28 SV2.11
B17  (via drill 0.3)
  Top 0.152: v35.3,41.2 35.3,39.9 35.8,39.4 35.8,33.8 34.5,33.8 IC1.12 | v54,38.2 54.2,38 54.2,31.7 54.9,31 SV2.12
  Bottom 0.152: v35.3,41.2 35.4,41.1 51.1,41.1 v54,38.2
B18  (via drill 0.3)
  Top 0.152: v32.5,32.7 32.5,31.8 33.1,31.8 IC1.8 | v44.2,35.6 44.6,35.2 v44.6,34.4
  Bottom 0.152: v32.5,32.7 36.4,36.6 43.2,36.6 v44.2,35.6 | v44.6,34.4 45,34 53.6,34 54.5,33.1 SV2.13
B19  (via drill 0.3)
  Top 0.152: v32.5,29.6 33.1,29.6 IC1.4 | v46.9,29.8 47.8,30.7 v47.8,34.6
  Bottom 0.152: v32.5,29.6 33.8,28.3 37,28.3 37.1,28.2 42.4,28.2 44,29.8 v46.9,29.8 | v47.8,34.6 48.2,35 54.6,35 SV2.14
B20  (via drill 0.3)
  Top 0.152: v21.8,24.5 20.8,25.5 20.8,27.2 21.7,28.1 IC1.48 | v38,17.4 v40.2,19.6 | v45.9,20.6 47.4,22.1 v47.4,23.5 | v51.6,25 51.8,25.2 51.8,36.6 v51.6,36.8
  Bottom 0.152: v21.8,24.5 28.5,17.8 35.9,17.8 36,17.9 36.7,17.9 37.2,17.4 v38,17.4 | v40.2,19.6 40.4,19.4 42.7,19.4 43.9,20.6 v45.9,20.6 | v47.4,23.5 48.9,25 v51.6,25 | v51.6,36.8 52.4,37.6 54.5,37.6 SV2.15
B21  (via drill 0.3)
  Top 0.152: v20.8,30 20.8,30.1 21.7,30.1 IC1.44 | v14,32.4 13,33.4 v13,42 | v8.5,44 7.9,44.6 7.9,45.4 v13.9,51.4 | v52.4,51.4 54.2,49.6 54.2,41.8 54.9,41.1 SV2.16
  Bottom 0.152: v20.8,30 19.6,31.2 15.2,31.2 v14,32.4 | v13,42 11,44 v8.5,44 | v13.9,51.4 v52.4,51.4
B22  (via drill 0.3)
  Top 0.152: v23.7,33 23.7,32.3 23.1,32.3 IC1.40 | v28.3,34.7 31.9,34.7 v31.9,36.4
  Bottom 0.152: v23.7,33 25.6,34.9 28.1,34.9 v28.3,34.7 | v31.9,36.4 31.9,37.7 31,38.6 31,42.7 54.5,42.7 SV2.17
B23  (via drill 0.3)
  Top 0.152: v23.7,40.2 23.7,36.1 23.9,35.9 23.9,34.3 23.1,34.3 IC1.36 | v26.9,40.7 27.7,41.5 v27.7,43.1
  Bottom 0.152: v23.7,40.2 24.2,40.7 v26.9,40.7 | v27.7,43.1 29,44.4 40.9,44.4 41.4,43.9 53.2,43.9 54.5,45.2 SV2.18
B24  (via drill 0.3)
  Top 0.152: v24.3,44 24.3,38.4 IC1.32
  Bottom 0.152: v24.3,44 25.1,44.8 50.6,44.8 51.1,44.3 51.6,44.3 54.8,47.5 SV2.19
B25  (via drill 0.3)
  Top 0.152: v26.4,28.4 26.4,36.9 IC1.28 | v19,20.2 v19,27 | v45.4,16.9 46.6,18.1 JP-IO.4
  Bottom 0.152: v26.4,28.4 25,27 v19,27 | v19,20.2 19.3,20.5 21.6,20.5 27.7,14.4 41.7,14.4 44.2,16.9 v45.4,16.9
DM  (via drill 0.3)
  Top 0.152: R19.2 39.9,14.5 40.1,14.7 40.1,15.2 40.3,15.4 C8.1 40.9,19.7 TPDM.1 40.8,21.7 40.8,24.4 v38.9,26.3 | v35.9,26.7 35.9,27.9 36.1,28.1 36.1,33.3 34.5,33.3 IC1.11
  Bottom 0.152: v35.9,26.7 36.3,26.3 v38.9,26.3
DP  (via drill 0.3)
  Top 0.152: R18.2 36.4,14.5 35.9,15 35.9,15.2 35.7,15.4 C7.1 35.6,16.7 35.6,18.4 v36.8,19.6 | v35.3,25.3 35.3,27.8 35.7,28.2 35.7,32.9 34.9,32.9 34.8,32.8 34.5,32.8 IC1.10 | v38.9,24.1 40.3,22.7 40.3,21.7 39.8,21.2 39.8,21.1 TPDP.1
  Bottom 0.152: v35.3,25.3 36.5,24.1 v38.9,24.1 | v36.8,19.6 37.4,20.2 37.7,20.2 TPDP.1
GND  (via drill 0.3)
  Top 0.152: JTAG.14 43.4,50.4 42.2,50.4 JTAG.12 40.9,50.4 39.7,50.4 JTAG.10 | JTAG.4 32.1,50.4 33.3,50.4 JTAG.6 | R4.1 38.7,43.6 39.1,44 39.1,46.5 40,47.4 40,49 39.3,49.7 JTAG.10 | JTAG.8 37.1,50.4 38.3,50.4 JTAG.10 | v23.7,31.2 23.1,31.2 IC1.42 | v16.6,32.8 16.6,41 C2.- | 48.2,43.1 49.3,43.1 R8.1 | 48.2,43.1 47.7,43.1 R7.1 46.3,42.5 45.6,41.8 45.6,40.2 RST.2 45.2,38.1 45.2,33.7 RST.1 | 28.25,35.55 28.6,35.2 31.3,35.2 31.3,35.6 | 28.25,35.55 27.9,35.9 27.9,36.9 IC1.25 | 31.3,35.6 31.3,36.9 IC1.18 | v28.7,30.4 29.3,29.8 29.3,27 IC1.59 | v32.5,30.5 32.5,30.6 33.1,30.6 IC1.6 | v25.5,39.7 25.5,41.4 R9.2 | 31.3,35.6 v31.2,35.6 | v27,34.3 28.25,35.55 | 48.2,43.1 48.2,49 48.9,49.7 JTAG.18 | R14.2 11.8,16.6 12.8,15.6 12.8,14.9 13,14.7 IC3.2 13,13.6 10.8,11.4 10.8,11.2 10.5,10.9 7.7,10.9 7.7,4.7 8.5,3.9 C12.- 10.5,2.1 12,2.1 IC2.1 13.4,0.9 13.4,0.6 18.3,0.6 18.3,1.6 19.9,1.6 C11.- 22.1,2.9 30.2,2.9 30.2,1.2 30.3,1.1 31.9,1.1 31.9,3.6 USB.GND@1 33,5.3 R16.1 32.3,12.6 31.7,13.2 31.7,16.3 31.65,16.35 | C10.- 9.9,13.5 9.9,16.2 10.3,16.6 R14.2 | U$1.P$29 9.8,44.4 9.8,43.3 10.1,43 C1.- 11.9,41 12,40.9 v12,32.8 12,24.8 C3.- | v23.3,25.9 23.3,25.2 24.6,25.2 24.8,25.4 24.8,25.5 IC1.50 | C3.- 12.9,24.8 14.2,24.8 14.2,24.9 TPGN.1 | R14.2 11.8,17.8 12.1,18.1 12.1,22.7 C3.- | R11.1 50.5,26.8 50.5,25.2 R12.1 51,23.8 51.5,23.3 51.5,6.4 54.9,3 SV2.1 | C8.2 38.6,16.1 37.4,16.1 C7.2 36.2,16.7 v36.2,17.3 | 31.65,16.35 32.4,17.1 33.4,17.1 33.4,17.4 C5.2 33.9,17.4 v33.9,16.8 | 31.65,16.35 30.5,15.2 30.5,14.6 27.1,14.6 24.3,17.4 C4.2 | USB.GND@2 41.2,4.3 43.5,4.3 EINT0.1
  Bottom 0.152: JTAG.20 51,50.4 49.8,50.4 JTAG.18 48.5,50.4 47.3,50.4 JTAG.16 46,50.4 44.8,50.4 JTAG.14 | JTAG.6 34.6,50.4 35.8,50.4 JTAG.8 | C104.2 25.6,32.2 25.6,31.3 C103.2 25,31.2 v23.7,31.2 | C104.2 25,32.4 17,32.4 v16.6,32.8 16.3,32.9 16.2,33 12.2,33 v12,32.8 | 44,33.7 44,34.6 44.4,35 45.8,35 46.1,35.3 C107.1 | 44,33.7 44.8,33.7 RST.1 | C101.2 30,32.2 C105.2 30.8,33.5 31.1,33.5 31.1,35.5 31.05,35.55 | v28.7,30.4 29.3,30.4 C101.2 | C101.2 30.7,30.5 v32.5,30.5 32.8,30.6 37.3,30.6 C102.2 38.5,31.4 38.5,32.6 C106.2 38.7,33.7 44,33.7 | v25.5,39.7 28.1,37.1 29.5,37.1 31.05,35.55 | v31.2,35.6 31.1,35.6 31.05,35.55 | v27,34.3 26.1,34.3 26.1,33.6 C104.2 | v23.3,25.9 23.2,25.8 16.3,25.8 TPGN.1 | v36.2,17.3 35.7,16.8 v33.9,16.8 | R102.1 27,2.7 28.1,3.8 31.7,3.8 USB.GND@1 33.9,4.7 34.5,5.3 38.3,5.3 | 38.3,5.3 38.3,8.8 USB.GND | 38.3,5.3 39.6,5.3 USB.GND@2 | EINT0.2 44.9,9.8 45.1,9.8 45.1,8.5 C100.2 45.1,7.1 45.1,5.4 44.9,5.4 EINT0.1 45.5,3.9 45.7,3.9 46.9,2.7 R100.1 48,2.4 54.5,2.4 SV2.1
N$1
  Bottom 0.152: R104.2 40.1,31.6 40.1,32.2 Q1.1
N$2
  Top 0.152: JP-DEB.1 R12.2
N$3
  Top 0.152: R19.1 38.9,11.5 38.9,8.5 37.7,7.3 35.9,7.3 35.9,7.6 USB.D-
N$4
  Top 0.152: R18.1 36.7,11.5 36.7,9.9 USB.D+
N$5
  Top 0.152: JP-BSL.1 R11.2
N$6
  Top 0.152: U$1.P$30 9.1,44.4 9.1,43.2 8.9,43 C1.+
N$7  (via drill 0.3)
  Top 0.152: v31.1,15 31.1,2.5 ACT.C
  Bottom 0.152: v31.1,15 31.4,15.3 36.5,15.3 R103.2
N$8
  Top 0.152: R7.2 47.7,45.5 47.8,45.6 47.8,50.5 48.7,51.4 50.2,51.4 50.2,49.2 49.5,48.5 JTAG.17
N$9
  Top 0.152: JP-IO.3 47.4,15.3 48.6,14.1 48.6,11.9 EINT0.4
  Bottom 0.152: R101.1 31.5,2.7 31.6,2.8 40.7,2.8 43.1,5.2 43.1,12.2 47.1,12.2 48,11.3 EINT0.4 48,10.4 48,8.5 C100.1 48,7.1 48.6,7.1 48.6,5.4 EINT0.3
N$10
  Top 0.152: R8.2 50.7,45.5 51.4,46.2 51.4,47.2 JTAG.19
N$11
  Top 0.152: A1.A 47,2.5 45.8,3.7 45.8,14.4 44.9,15.3 JP-IO.1
N$12  (via drill 0.3)
  Top 0.152: v44.3,2 A1.C
  Bottom 0.152: R100.2 v44.3,2
N$13  (via drill 0.3)
  Top 0.152: v23.3,2 VCC.C
  Bottom 0.152: R102.2 v23.3,2
N$14
  Top 0.152: T1.3 19.8,18.9 20.3,18.4 20.3,16.2 TPHI.1 20.4,14.2 20.4,13.2 C9.1 19.8,11.8 18.1,11.8 18.1,11.4 L1.1 15.5,11.4 14.4,11.4 IC3.6 14,11 14,10.7 12.8,10.7 12.5,11 IC3.4 12.1,11 12.1,10.5 10.1,10.5 C10.+
N$15  (via drill 0.3)
  Top 0.152: v22.6,46.7 22.6,45.3 U$1.P$3 | v21,42.8 20.4,42.8 C2.+
  Bottom 0.152: v22.6,46.7 22.2,47.1 20.5,47.1 20.1,46.7 20.1,44.3 23.3,44.3 23.7,43.9 23.7,42.8 v21,42.8
N$16
  Top 0.152: U$1.P$4 22.3,44.4 22.3,43.3 22.7,42.9 R9.1
N$17
  Top 0.152: IC3.1 14.4,14.7 14.5,14.8 14.5,15.1 D1.A 16.8,15.1 16.8,14.2 L1.2
N$18  (via drill 0.3)
  Top 0.152: C6.1 8.6,17.7 8.7,17.8 8.7,19.4 R13.1 9,20.8 9,22.7 C3.+ 9.9,24.8 11.4,26.3 v11.4,27.5 | v23.1,43.7 23.1,44.4 U$1.P$2 | v15,42 15,29.1 TP1.1 15.7,27.1 16.6,26.2 16.6,21.8 D1.C
  Bottom 0.152: v23.1,43.7 22.8,43.4 16.4,43.4 v15,42 | v11.4,27.5 11.6,27.7 14.2,27.7 TP1.1
N$19
  Top 0.152: R14.1 11.8,14.7 12.1,14.7 IC3.3 12.1,13.6 10.4,11.9 10.4,11.3 7.7,11.3 7.7,14.8 C6.2 8.6,16 9.9,17.3 9.9,18.7 10.6,19.4 R13.2
N$20  (via drill 0.3)
  Top 0.152: v16.1,3.2 15.7,2.8 IC2.2 14.3,2.8 14.3,5.1 10.5,5.1 C12.+
  Bottom 0.152: v16.1,3.2 22,3.2 24.3,5.5 R20.2
N$21
  Top 0.152: T1.1 21.8,18 22.1,17.7 22.1,13.2 C9.2 22.6,11.8 22.6,9 23.4,9 23.8,9.4 23.8,11.8 24.2,12.2 R15.2
N$22
  Top 0.152: R15.1 25.7,14.1 27.7,14.1 27.7,13.6 JP-BOOST.2
N$23
  Top 0.152: IC1.62 30.8,26.24 30.8,21.85 Q2.1 32.3,20.9 32.3,18.8 C5.1
N$24
  Top 0.152: IC1.61 30.3,26.24 30.3,21.85 Q2.2 25.5,20.9 25.5,18.8 C4.1
N$25  (via drill 0.3)
  Top 0.152: v35.1,29.2 34.5,29.2 IC1.3
  Bottom 0.152: R104.1 39.3,29.2 38.7,29.2 C102.1 37.3,29.2 v35.1,29.2
N$26  (via drill 0.3)
  Top 0.152: v35.1,31.5 35.1,30.3 34.5,30.3 IC1.5
  Bottom 0.152: Q1.2 39.4,35.1 38.7,35.1 C106.1 37.3,34.3 37,34 34.5,34 34.5,32.1 v35.1,31.5
RESET  (via drill 0.3)
  Top 0.152: RST.3 49.7,33.7 49.7,38.1 RST.4 | v27.3,28.2 27.3,28.3 28.1,28.3 28.5,27.9 28.5,27.5 28.4,27.4 28.4,27 IC1.57 | v42,27.6 42.7,28.3 42.7,38.2 | 42.7,38.2 42.7,39.3 42.5,39.5 42.5,39.9 44.7,42.1 45.1,42.1 45.1,44 44.7,44.4 R6.1 44.7,45.5 44.7,45.6 46.3,47.2 JTAG.15 | 42.7,38.2 v42.5,38.2
  Bottom 0.152: C107.2 48.9,36.7 50.5,36.7 50.9,37.1 50.9,38.1 50.2,38.1 RST.4 48.7,38.7 47.8,37.8 44.6,37.8 44.2,38.2 v42.5,38.2 | v27.3,28.2 27.3,27.1 35.5,27.1 35.7,27.3 36.1,27.3 36.3,27.1 41.5,27.1 v42,27.6
RTCK  (via drill 0.3)
  Top 0.152: v27.7,40.7 28.3,40.1 28.3,38.4 IC1.24 | v26.9,41.5 26.8,41.6 v26.8,46.2 | v42,26.8 40.9,27.9 40.9,41.2 39.9,42.2 39.9,43.9 40,44 42.1,44 42.1,47.5 JTAG.11
  Bottom 0.152: v27.7,40.7 v26.9,41.5 | v26.8,46.2 27.5,46.9 40.2,46.9 40.9,47.6 JTAG.11 | v42,26.8 42.1,26.8 43.3,25.6 JP-DEB.2
TCK  (via drill 0.3)
  Top 0.152: v27.9,27.7 27.9,27 IC1.56 | v36.5,27.7 36.5,43.6 37.3,44.4 R4.2 38.7,45.5 38.7,47.2 JTAG.9
  Bottom 0.152: v27.9,27.7 v36.5,27.7
TDI  (via drill 0.3)
  Top 0.152: v28.1,29.4 28.1,31 28.9,31 29.8,30.1 29.8,27 IC1.60 | v13.2,32.4 12.4,33.2 v12.4,43.4 | v8.5,44.8 8.8,45.1 8.8,45.5 v11.2,47.9 | R2.1 32.7,45.5 33.6,46.4 33.6,47.2 JTAG.5
  Bottom 0.152: v28.1,29.4 19.1,29.4 17.7,30.8 14.8,30.8 v13.2,32.4 | v12.4,43.4 11,44.8 v8.5,44.8 | v11.2,47.9 27.4,47.9 28.4,48.9 32.6,48.9 33.3,48.2 JTAG.5
TDO
  Top 0.152: IC1.64 31.9,25.5 32.8,25.5 33.6,24.7 37.1,24.7 37.1,28 36.9,28.2 36.9,40 39.5,42.6 39.5,44 40.3,44.8 R5.1 40.6,45.5 40.6,49 42.5,49 43.4,48.1 JTAG.13
TMS  (via drill 0.3)
  Top 0.152: v25.7,36.4 25.8,36.3 25.8,27 IC1.52 | v5.2,36.9 5,37.1 5,44.1 v12.9,52 | v33.2,52.6 35.5,50.3 35.5,49.1 36.1,48.5 JTAG.7 36.2,47.2 36.2,46 35.7,45.5 R3.1
  Bottom 0.152: v25.7,36.4 24.6,37.5 22.9,37.5 22.4,37 8,37 7.8,36.8 5.3,36.8 v5.2,36.9 | v12.9,52 13.5,52.6 v33.2,52.6
TRST  (via drill 0.3)
  Top 0.152: v30.3,42.5 30.3,38.4 IC1.20 | v30.3,43.8 29.7,44.4 R1.1 29.7,45.5 29.7,45.8 31.1,47.2 JTAG.3
  Bottom 0.152: v30.3,42.5 v30.3,43.8
VIN
  Top 0.152: IC2.3 18,2.8 19.9,4.7 19.9,8 C11.+ 22.1,8 22.1,6.3 28.1,6.3 JP-VUSB.1
VUSB
  Top 0.152: R17.2 35.1,11.5 35.1,9.9 USB.VBUS
  Bottom 0.152: JP-VUSB.2 30.7,8.8 31,9.1 34.3,9.1 USB.VBUS

### Text on the board
tNames: VCC | 0.0 | 1.24 | 0.1 | 1.23 | 0.2 | 1.22 | 0.3 | 1.21 | 0.4 | 0.5 | 1.20 | 1.19 | 0.6 | 1.18 | 0.7 | BUZZI-19b | 1.17 | 0.8 | 0.9 | 1.16 | 0.31 | 0.10 | 0.30 | 0.11 | 0.12 | 0.29 | 0.28 | 0.13 | 0.25 | 0.14 | 0.23 | 0.15 | 0.22 | 0.16 | 0.21 | 0.17 | 0.20 | 0.18 | GND | 0.19